# EAGLE design LedController2 (EAGLE 6.4)
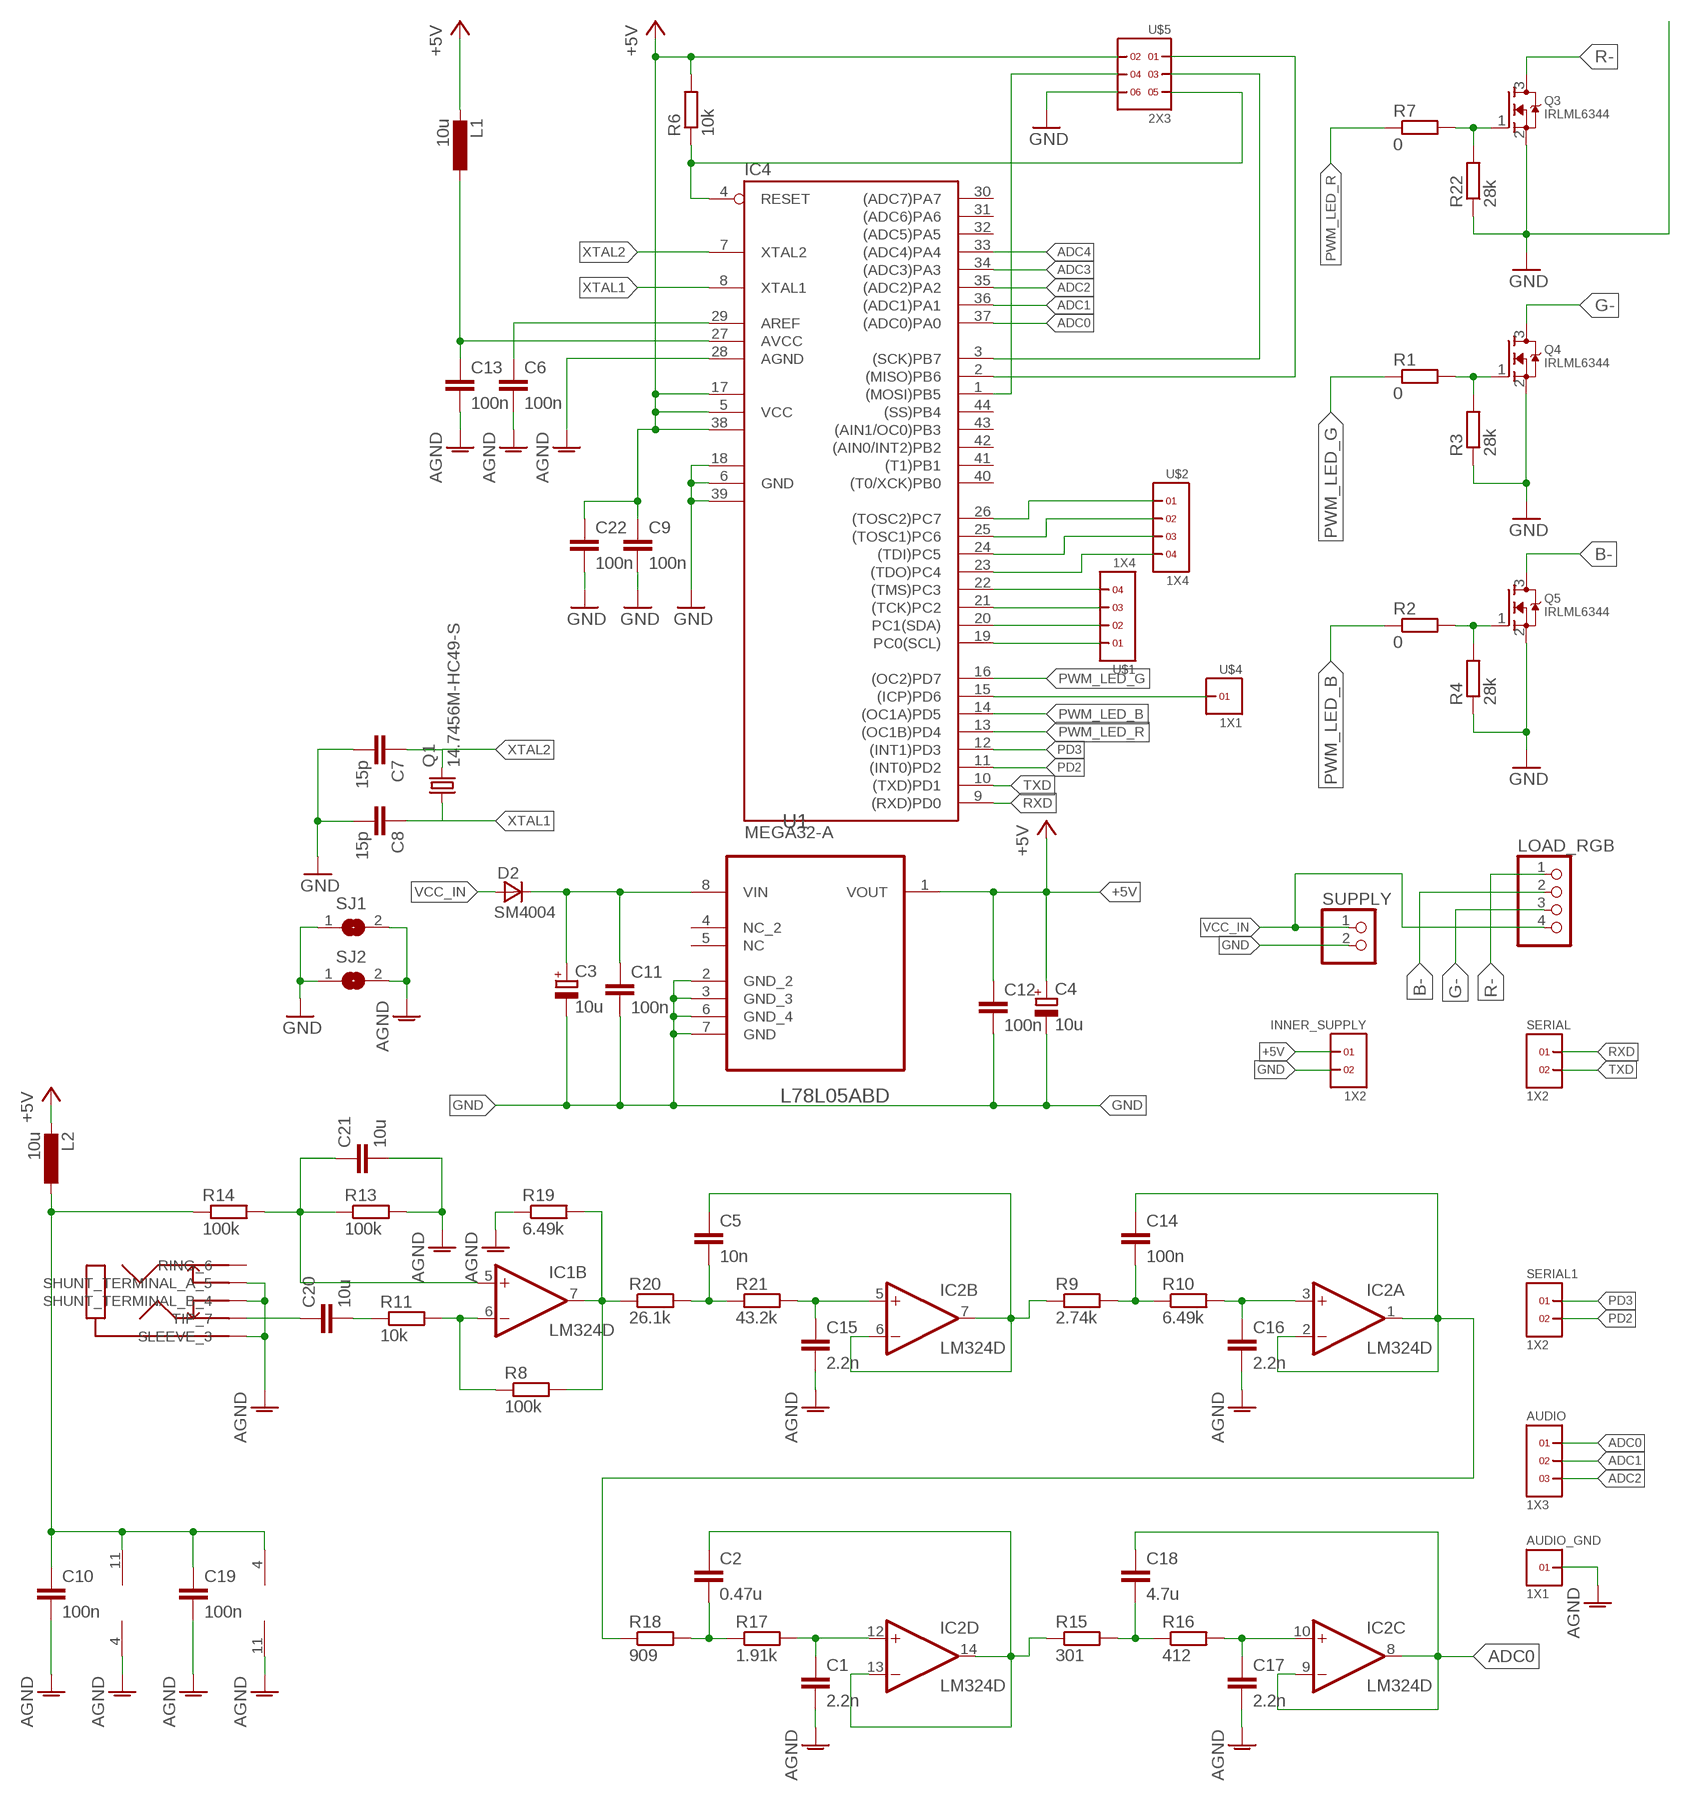
[diagram p0: schematic, sheet 1]

## Parts
AUDIO  1X3  [1X3]
AUDIO_GND  1X1  [1X1]
C1  2.2n  C-EUC0805  [C0805]
C2  0.47u  C-EUC0805  [C0805]
C3  10u  CPOL-EUSMCC  [SMC_C]
C4  10u  CPOL-EUSMCC  [SMC_C]
C5  10n  C-EUC0805  [C0805]
C6  100n  C-EUC0805  [C0805]
C7  15p  C-EUC0805  [C0805]
C8  15p  C-EUC0805  [C0805]
C9  100n  C-EUC0805  [C0805]
C10  100n  C-EUC0805  [C0805]
C11  100n  C-EUC0805  [C0805]
C12  100n  C-EUC0805  [C0805]
C13  100n  C-EUC0805  [C0805]
C14  100n  C-EUC0805  [C0805]
C15  2.2n  C-EUC0805  [C0805]
C16  2.2n  C-EUC0805  [C0805]
C17  2.2n  C-EUC0805  [C0805]
C18  4.7u  C-EUC0805  [C0805]
C19  100n  C-EUC0805  [C0805]
C20  10u  C-EUC0805  [C0805]
C21  10u  C-EUC0805  [C0805]
C22  100n  C-EUC0805  [C0805]
D2  SM4004  [MELF-MLL41]
IC1  LM324D  [SO14]
IC2  LM324D  [SO14]
IC4  MEGA32-A  [TQFP44]
INNER_SUPPLY  1X2  [1X2]
L1  10u  L-EUL1812  [L1812]
L2  10u  L-EUL1812  [L1812]
LOAD_RGB  PINHD-1X4/90  [1X04/90]
Q1  14.7456M-HC49-S  CRYSTALHC49S  [HC49/S]
Q3  IRLML6344  MOSFET-NREFLOW  [SOT23]
Q4  IRLML6344  MOSFET-NREFLOW  [SOT23]
Q5  IRLML6344  MOSFET-NREFLOW  [SOT23]
R1  0  R-EU_R0805  [R0805]
R2  0  R-EU_R0805  [R0805]
R3  28k  R-EU_R0805  [R0805]
R4  28k  R-EU_R0805  [R0805]
R6  10k  R-EU_R0805  [R0805]
R7  0  R-EU_R0805  [R0805]
R8  100k  R-EU_R0805  [R0805]
R9  2.74k  R-EU_R0805  [R0805]
R10  6.49k  R-EU_R0805  [R0805]
R11  10k  R-EU_R0805  [R0805]
R13  100k  R-EU_R0805  [R0805]
R14  100k  R-EU_R0805  [R0805]
R15  301  R-EU_R0805  [R0805]
R16  412  R-EU_R0805  [R0805]
R17  1.91k  R-EU_R0805  [R0805]
R18  909  R-EU_R0805  [R0805]
R19  6.49k  R-EU_R0805  [R0805]
R20  26.1k  R-EU_R0805  [R0805]
R21  43.2k  R-EU_R0805  [R0805]
R22  28k  R-EU_R0805  [R0805]
SERIAL  1X2  [1X2]
SERIAL1  1X2  [1X2]
SJ1  SJ  [SJ]
SJ2  SJ  [SJ]
SUPPLY  PINHD-1X2/90  [1X02/90]
U1  L78L05ABD  [SOIC127P600X175-8N]
U$1  1X4  [1X4]
U$2  1X4  [1X4]
U$4  1X1  [1X1]
U$5  2X3  [2X3]
U$6  JACK35  [JACK35]

## Nets
+5V: C4.+ C9.1 C12.1 C22.1 IC4.5(VCC) IC4.17(VCC1) IC4.38(VCC2) INNER_SUPPLY.1 L1.2 L2.2 R6.2 U1.1(VOUT) U$5.2
ADC0: AUDIO.1 C18.1 IC2.8(C:OUT) IC2.9(C:-IN) IC4.37((ADC0)PA0)
ADC1: AUDIO.2 IC4.36((ADC1)PA1)
ADC2: AUDIO.3 IC4.35((ADC2)PA2)
ADC3: IC4.34((ADC3)PA3)
ADC4: IC4.33((ADC4)PA4)
AGND: AUDIO_GND.1 C1.2 C6.2 C10.2 C13.2 C15.2 C16.2 C17.2 C19.2 C21.2 IC1.11(P:V-) IC2.4(P:V+) IC4.28(AGND) R13.2 R19.1 SJ1.2 SJ2.2 U$6.SHUNT_TERMINAL_A_5 U$6.SHUNT_TERMINAL_B_4 U$6.SLEEVE_3
AREF: C6.1 IC4.29(AREF)
AVCC: C13.1 IC4.27(AVCC) L1.1
B-: LOAD_RGB.2 Q5.3(D)
G-: LOAD_RGB.3 Q4.3(D)
GND: C3.- C4.- C7.2 C8.2 C9.2 C11.2 C12.2 C22.2 IC4.6(GND) IC4.18(GND1) IC4.39(GND2) INNER_SUPPLY.2 Q3.2(S) Q4.2(S) Q5.2(S) R3.1 R4.1 R22.1 SJ1.1 SJ2.1 SUPPLY.2 U1.2(GND_2) U1.3(GND_3) U1.6(GND_4) U1.7(GND) U$5.6
N$1: C20.2 R11.1
N$2: Q3.1(G) R7.2 R22.2
N$3: IC4.3((SCK)PB7) U$5.3
N$4: IC4.2((MISO)PB6) U$5.1
N$5: Q4.1(G) R1.2 R3.2
N$6: C3.+ C11.1 D2.C U1.8(VIN)
N$7: IC1.7(B:OUT) R8.2 R19.2 R20.1
N$8: C14.2 R9.2 R10.1
N$9: Q5.1(G) R2.2 R4.2
N$10: IC4.1((MOSI)PB5) U$5.4
N$11: IC1.6(B:-IN) R8.1 R11.2
N$12: C5.1 IC2.6(B:-IN) IC2.7(B:OUT) R9.1
N$13: C10.1 C19.1 IC1.4(P:V+) IC2.11(P:V-) L2.1 R14.1
N$14: C21.1 IC1.5(B:+IN) R13.1 R14.2
N$15: C15.1 IC2.5(B:+IN) R21.2
N$16: C16.1 IC2.3(A:+IN) R10.2
N$17: C17.1 IC2.10(C:+IN) R16.2
N$18: C2.1 IC2.13(D:-IN) IC2.14(D:OUT) R15.1
N$19: C5.2 R20.2 R21.1
N$20: C18.2 R15.2 R16.1
N$21: C14.1 IC2.1(A:OUT) IC2.2(A:-IN) R18.1
N$22: C1.1 IC2.12(D:+IN) R17.2
N$23: C2.2 R17.1 R18.2
N$24: C20.1 U$6.TIP_7
N$25: IC4.22((TMS)PC3) U$1.4
N$26: IC4.21((TCK)PC2) U$1.3
N$27: IC4.20(PC1(SDA)) U$1.2
N$28: IC4.19(PC0(SCL)) U$1.1
N$29: IC4.23((TDO)PC4) U$2.4
N$30: IC4.24((TDI)PC5) U$2.3
N$33: IC4.25((TOSC1)PC6) U$2.2
N$34: IC4.26((TOSC2)PC7) U$2.1
N$35: IC4.15((ICP)PD6) U$4.1
PD2: IC4.11((INT0)PD2) SERIAL1.2
PD3: IC4.12((INT1)PD3) SERIAL1.1
PWM_LED_B: IC4.14((OC1A)PD5) R2.1
PWM_LED_G: IC4.16((OC2)PD7) R1.1
PWM_LED_R: IC4.13((OC1B)PD4) R7.1
R-: LOAD_RGB.1 Q3.3(D)
RESET: IC4.4(RESET) R6.1 U$5.5
RXD: IC4.9((RXD)PD0) SERIAL.1
TXD: IC4.10((TXD)PD1) SERIAL.2
VCC_IN: D2.A LOAD_RGB.4 SUPPLY.1
XTAL1: C8.1 IC4.8(XTAL1) Q1.1
XTAL2: C7.1 IC4.7(XTAL2) Q1.2
Unconnected: IC1.1(A:OUT) IC1.2(A:-IN) IC1.3(A:+IN) IC1.8(C:OUT) IC1.9(C:-IN) IC1.10(C:+IN) IC1.12(D:+IN) IC1.13(D:-IN) IC1.14(D:OUT) IC4.30((ADC7)PA7) IC4.31((ADC6)PA6) IC4.32((ADC5)PA5) IC4.40((T0/XCK)PB0) IC4.41((T1)PB1) IC4.42((AIN0/INT2)PB2) IC4.43((AIN1/OC0)PB3) IC4.44((SS)PB4) U1.4(NC_2) U1.5(NC) U$6.RING_6

## Library data of the parts
AUDIO = headers-2mm:1X3
AUDIO_GND U$4 = headers-2mm:1X1
C1 C2 C5-C22 = rcl:C-EU: CAPACITOR, European symbol
C3 C4 = rcl:CPOL-EU: POLARIZED CAPACITOR, European symbol
D2 = _mod_diode:SM400*: SM4001 .. SM4007 General Purpose Rectifier, 1 A SMD-Version of 1N4001 .. 1N4007 Case: MELF-MLL41 = DO 213 AB Author: Dipl.-Ing. FH Rainer Bayer HHN Hochschule Heilbronn, rainer.bayer@hs-heilbronn.de Ingenieurbüro ing-rb, mail@ing-rb.de
IC1 IC2 = linear:LM324: OP AMP
IC4 = avr-6:MEGA32: MICROCONTROLLER 32 Kbytes FLASH 2 Kbytes SRAM 1 Kbytes EEPROM USART 8-channel 10 bit ADC
INNER_SUPPLY SERIAL SERIAL1 = headers-2mm:1X2
L1 L2 = rcl:L-EU: INDUCTOR, European symbol
LOAD_RGB = pinhead:PINHD-1X4: PIN HEADER
Q1 = crystal:CRYSTAL: CRYSTAL; OC_FARNELL: 1667008; OC_NEWARK: unknown
Q3-Q5 = adafruit:MOSFET-N: N-Channel Mosfet 2N7002E - 60V 260mA SOT23 [Digikey: 2N7002ET1GOSTR-ND] - REEL BSH103 - 30V 850mA SOT23 [Digikey: 568-5013-1-ND]
R1-R4 R6-R11 R13-R22 = rcl:R-EU_: RESISTOR, European symbol
SJ1 SJ2 = jumper:SJ: SMD solder JUMPER
SUPPLY = pinhead:PINHD-1X2: PIN HEADER
U1 = l78l05ABD_smd_so8:L78L05ABD: POSITIVE VOLTAGE REGULATORS; MPN: L78L05ABD; OC_FARNELL: 1087098; OC_NEWARK: -; PACKAGE: 8-SOIC; SUPPLIER: STMICROELECTRONICS
U$1 U$2 = headers-2mm:1X4
U$5 = headers-2mm:2X3
U$6 = led-controller-2.1:JACK35

## Board
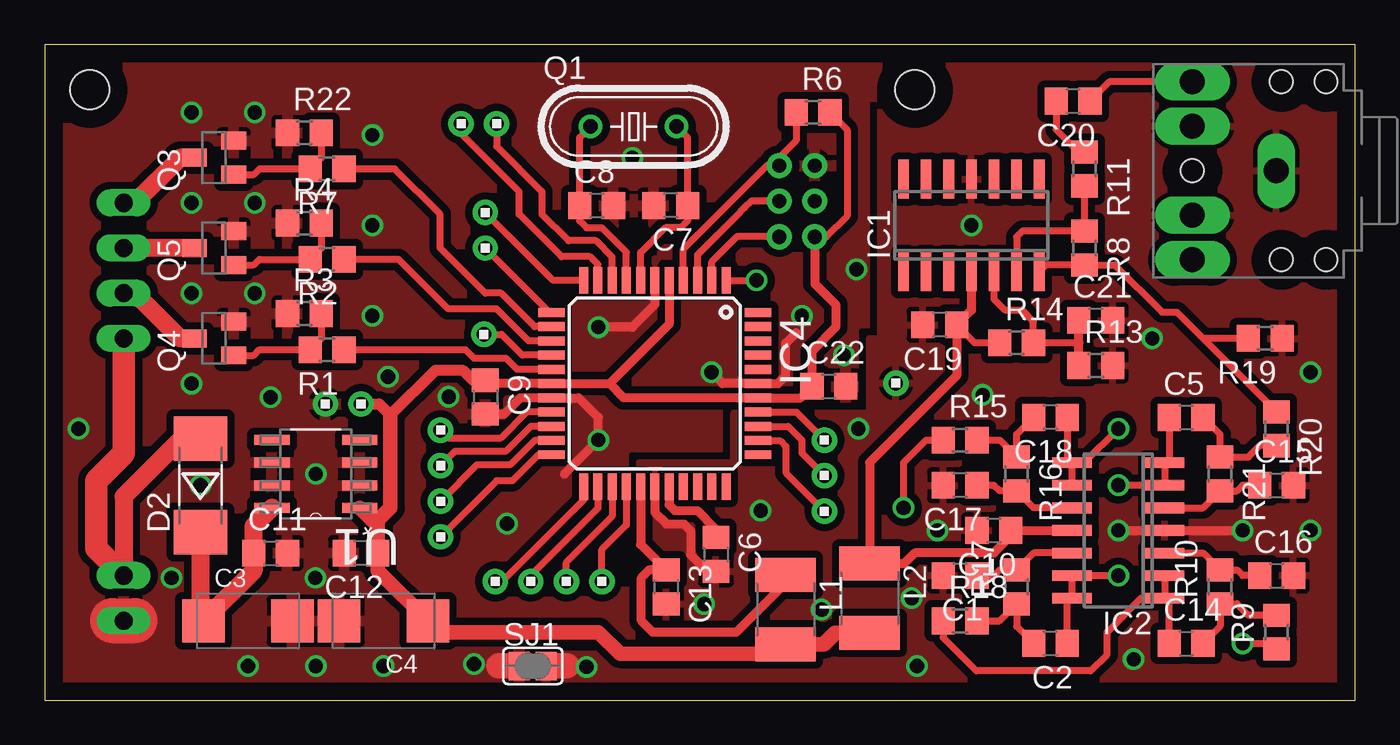
[diagram p1: board, top side]
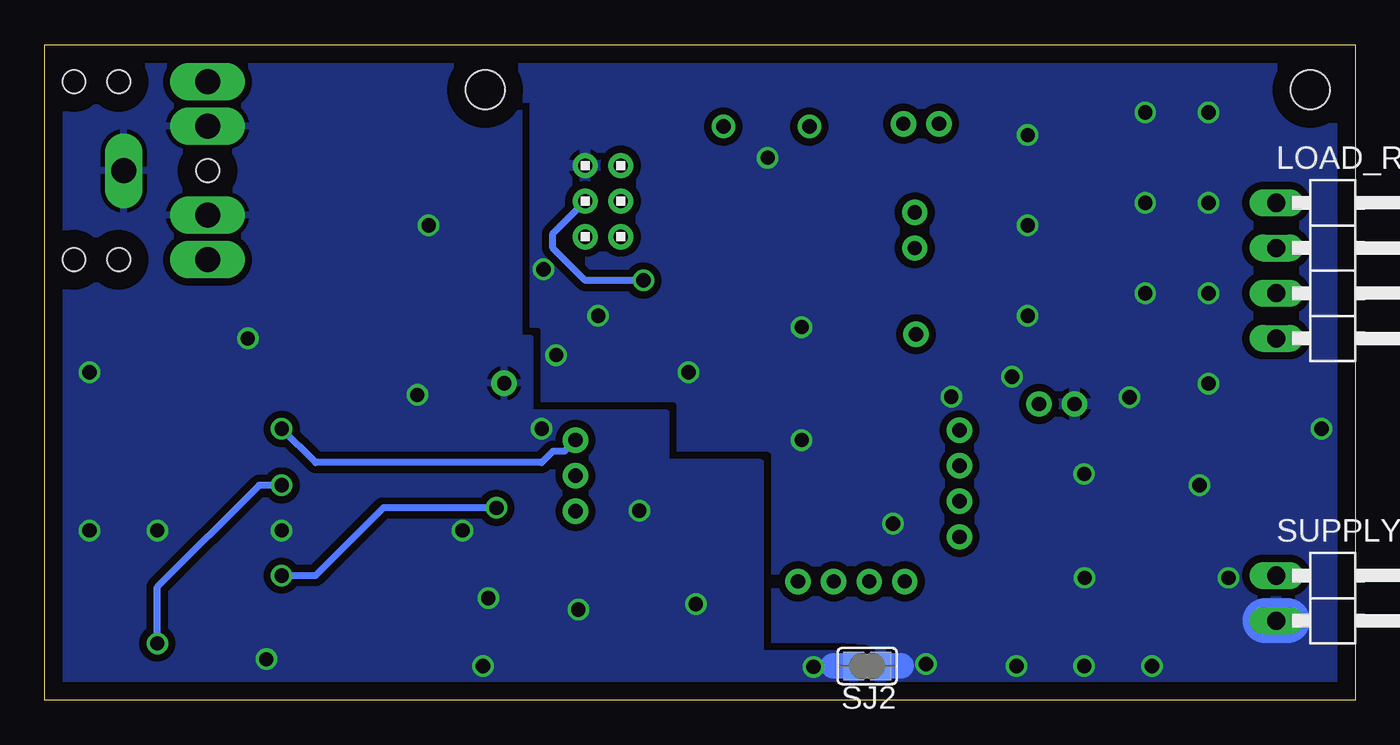
[diagram p2: board, bottom side, seen from below]

Size 73.65 x 36.86 mm. Coordinates in mm from the lower left corner, seen from the top.
Outline: 0,36.86 0,0 73.65,0 73.65,36.86 0,36.86
Copper layers (1*16): Top 0.035mm / dielectric 1.5mm / Bottom 0.035mm
Design rules "default": minimum track width 10mil, minimum drill 24mil, track to track 8mil, track to pad 8mil, pad to pad 8mil, via to via 8mil, smd to smd 8mil, copper to edge 40mil, drill to drill 8mil, minimum pad ring 10mil, minimum via ring 8mil, stop-mask expansion 4mil, vias tented up to drill 0mil, thermal gap 10mil
Holes 2.2 mm at 2.54,34.32 48.9,34.32

### Footprints (pad centres in the part's own frame; a part is rotated, then mirrored left to right if it is on the bottom)
1X3 = drill 0.8 pad 1.422: 1 0,0; 2 2,0; 3 4,0
1X1 = drill 0.8 pad 1.422: 1 0,0
C0805 = smd 1.3 x 1.5: 1 -0.95,0; 2 0.95,0
SMC_C = smd 2.4 x 2.4: + -2.5,0; - 2.5,0
MELF-MLL41 = smd 2.5 x 3: A 2.625,0; C -2.625,0
SO14 = smd 0.6 x 2.2: 1 -3.81,-2.6; 2 -2.54,-2.6; 3 -1.27,-2.6; 4 0,-2.6; 5 1.27,-2.6; 6 2.54,-2.6; 7 3.81,-2.6; 8 3.81,2.6; 9 2.54,2.6; 10 1.27,2.6; 11 0,2.6; 12 -1.27,2.6; 13 -2.54,2.6; 14 -3.81,2.6
TQFP44 = smd 1.5 x 0.5: 1 -5.8,4; 2 -5.8,3.2; 3 -5.8,2.4; 4 -5.8,1.6; 5 -5.8,0.8; 6 -5.8,0; 7 -5.8,-0.8; 8 -5.8,-1.6; 9 -5.8,-2.4; 10 -5.8,-3.2; 11 -5.8,-4; 23 5.8,-4; 24 5.8,-3.2; 25 5.8,-2.4; 26 5.8,-1.6; 27 5.8,-0.8; 28 5.8,0; 29 5.8,0.8; 30 5.8,1.6; 31 5.8,2.4; 32 5.8,3.2; 33 5.8,4 | smd 0.5 x 1.5: 12 -4,-5.8; 13 -3.2,-5.8; 14 -2.4,-5.8; 15 -1.6,-5.8; 16 -0.8,-5.8; 17 0,-5.8; 18 0.8,-5.8; 19 1.6,-5.8; 20 2.4,-5.8; 21 3.2,-5.8; 22 4,-5.8; 34 4,5.8; 35 3.2,5.8; 36 2.4,5.8; 37 1.6,5.8; 38 0.8,5.8; 39 0,5.8; 40 -0.8,5.8; 41 -1.6,5.8; 42 -2.4,5.8; 43 -3.2,5.8; 44 -4,5.8
1X2 = drill 0.8 pad 1.422: 1 0,0; 2 2,0
L1812 = smd 1.9 x 3.4: 1 -1.95,0; 2 1.95,0
1X04/90 = drill 1.016 long: 1 -3.81,-3.81; 2 -1.27,-3.81; 3 1.27,-3.81; 4 3.81,-3.81
HC49/S = drill 0.813: 1 -2.413,0; 2 2.413,0
SOT23 = smd 1 x 1.4: 1 -0.95,-1.1; 2 0.95,-1.1; 3 0,1.1
R0805 = smd 1.3 x 1.5: 1 -0.95,0; 2 0.95,0
SJ = smd 1.168 x 1.6: 1 -0.762,0; 2 0.762,0
1X02/90 = drill 1.016 long: 1 -1.27,-3.81; 2 1.27,-3.81
SOIC127P600X175-8N = smd 1.981 x 0.559: 1 -2.464,1.905; 2 -2.464,0.635; 3 -2.464,-0.635; 4 -2.464,-1.905; 5 2.464,-1.905; 6 2.464,-0.635; 7 2.464,0.635; 8 2.464,1.905
1X4 = drill 0.8 pad 1.422: 1 0,0; 2 2,0; 3 4,0; 4 6,0
2X3 = drill 0.8 pad 1.422: 1 0,0; 2 0,2; 3 2,0; 4 2,2; 5 4,0; 6 4,2
JACK35 = drill 1.4 long: RING_6 0,5; SHUNT_TERMINAL_A_5 0,2.5; SHUNT_TERMINAL_B_4 0,-2.5; SLEEVE_3 -4.7,0; TIP_7 0,-5 | hole 1.3: -7.5,5; -5,5; -5,-5; -7.5,-5; 0,0

### Placement (x,y rotation side)
AUDIO  43.81,14.63 270 top
AUDIO_GND  47.83,17.83 0 top
C1  51.44,7.01 180 top
C2  56.52,3.2 180 top
C3  11.43,4.47 0 top
C4  19.05,4.47 180 top
C5  64.14,15.9 0 top
C6  37.72,8.2 270 top
C7  35.18,27.81 180 top
C8  31.01,27.81 0 top
C9  24.77,17.04 270 top
C10  53.34,9.55 180 top
C11  12.7,8.28 0 top
C12  17.78,8.28 180 top
C13  34.92,6.38 270 top
C14  64.14,3.2 0 top
C15  69.22,12.09 0 top
C16  69.22,7.01 0 top
C17  51.44,12.09 180 top
C18  56.52,15.9 180 top
C19  50.29,21.11 180 top
C20  57.78,33.68 180 top
C21  59.05,21.36 0 top
C22  44.07,17.65 0 top
D2  8.76,12.09 90 top
IC1  52.07,26.7 0 top
IC2  60.33,9.55 90 top
IC4  34.29,17.81 270 top
INNER_SUPPLY  17.78,16.66 180 top
L1  41.63,5.11 270 top
L2  46.35,5.74 270 top
LOAD_RGB  0.64,24.16 270 bottom
Q1  33.1,32.26 0 top
Q3  9.53,30.51 90 top
Q4  9.53,20.35 90 top
Q5  9.53,25.43 90 top
R1  15.88,19.71 180 top
R2  15.88,24.79 180 top
R3  14.61,21.74 0 top
R4  14.61,26.82 0 top
R6  43.18,33.05 0 top
R7  15.88,29.87 180 top
R8  58.42,25.43 270 top
R9  69.22,3.84 90 top
R10  66.04,6.38 90 top
R11  58.42,29.87 270 top
R13  59.05,18.82 0 top
R14  54.61,20.09 0 top
R15  51.44,14.63 0 top
R16  54.61,12.73 270 top
R17  54.61,6.38 90 top
R18  51.44,4.47 0 top
R19  68.58,20.35 180 top
R20  69.22,15.27 270 top
R21  66.04,12.73 270 top
R22  14.61,31.9 0 top
SERIAL  25.4,32.41 180 top
SERIAL1  24.77,25.43 90 top
SJ1  27.43,1.93 0 top
SJ2  27.43,1.93 180 bottom
SUPPLY  0.64,5.74 270 bottom
U1  15.24,12.73 180 top
U$1  22.25,15.19 270 top
U$2  31.32,6.68 180 top
U$4  24.69,20.57 0 top
U$5  41.27,26.06 90 bottom
U$6  64.49,29.77 180 top

### Tracks (layer width: path | path; a pad name or v marks a point on that pad's centre or on a via)
+5V
  Top 0.406: R6.2 45.09,32.09 45.09,27.23 43.92,26.06 U$5.2
  Top 0.508: 31.75,17.81 IC4.17 24.95,17.81 C9.1 | 31.75,17.81 35.09,21.15 IC4.5 | 31.75,17.81 32.55,17.01 IC4.38 42.47,17.01 C22.1 43.12,19.65 44.45,20.98 44.45,22.25 43.27,23.43 U$5.2
  Top 0.61: 24.45,17.99 C9.1 24.07,17.99 23.5,18.57 21.97,18.57 19.43,16.03 | 19.43,15.9 19.43,16.03 | INNER_SUPPLY.1 18.8,16.66 19.43,16.03
  Top 0.813: 18.73,9.79 C12.1 18.73,7.29 C4.+ 22.18,3.84 31.11,3.84 32.33,2.62 41.09,2.62 L1.2 43.81,3.16 44.45,3.79 | 18.73,9.79 U1.1 | L2.2 44.45,3.79 | 44.45,3.79 44.41,3.79 43.81,3.2 | 18.73,9.79 18.73,10.12 19.43,10.82 19.43,15.9
ADC0  (via drill 0.8)
  Top 0.406: IC2.9 IC2.8 | C18.1 57.47,13.62 IC2.8 | v60.33,15.27 58.42,13.36 IC2.8 | IC4.37 42.24,16.21 AUDIO.1
  Bottom 0.406: AUDIO.1 44.45,14 45.09,14 45.72,13.36 58.42,13.36 v60.33,15.27
ADC1
  Top 0.406: IC4.36 41.77,15.41 42.55,14.63 42.55,13.9 AUDIO.2
ADC2
  Top 0.406: IC4.35 41.33,14.61 41.66,14.27 41.66,12.79 AUDIO.3
ADC4
  Top 0.406: IC4.33 38.29,11.8
AGND  (via drill 0.8)
  Top 0.508: v67.31,9.55 IC2.4 v60.33,9.55 | IC4.28 34.29,10.57 34.95,9.91 35.92,9.91 36.3,9.53 36.3,8.18 37.22,7.25 C6.2
  Top 1.422: 28.57,1.93 29.34,1.93
  Bottom 1.422: 28.57,1.93 29.34,1.93
  other vias: 40.23,10.67 48.72,5.74 43.66,5.11 61.19,2.31 49.02,1.93 50.16,9.55 52.7,17.17 62.23,20.35 45.72,15.27 52.07,26.7 37.06,5.41 30.45,1.88 71.12,18.44 71.12,9.55
  pour Bottom (isolate 0.406): 74.93,38.13 74.93,-0.61 33.4,-0.61 33.4,13.36 38.73,13.36 38.73,16.15 46.35,16.15 46.35,20.35 46.99,20.35 46.99,38.13
  pour Top (isolate 0.406): 74.3,-1.24 33.4,-1.24 33.4,13.36 38.73,13.36 38.73,16.15 46.35,16.15 46.35,20.35 46.99,20.35 46.99,38.76 74.3,38.76
  pour Bottom (isolate 0.406): 27.94,-2.51 27.94,1.93 28.57,2.57 33.66,2.57 34.29,1.93 34.29,-2.51
  pour Top (isolate 0.406): 27.94,-5.05 27.94,1.93 28.57,2.57 34.29,2.57 34.29,-5.05
AREF
  Top 0.508: IC4.29 35.09,10.99 35.41,10.67 36.66,10.67 37.72,9.61 C6.1
AVCC
  Top 0.508: IC4.27 33.49,8.76 C13.1 33.97,7.33 33.53,6.88 33.53,4.47 34.16,3.84 38.86,3.84 41.63,6.6 L1.1
B-
  Top 1.016: Q5.3 LOAD_RGB.2
G-
  Top 1.016: Q4.3 7.62,20.35 5.08,22.89 LOAD_RGB.3
GND  (via drill 0.8)
  Top 0.508: IC4.6 34.29,22.25 33.02,20.98 v31.11,20.98 | v37.47,18.44 38.1,17.81 IC4.39 41.2,17.81 41.63,18.24 41.63,20.07 42.23,20.66 | 29.21,12.73 v31.11,14.63 31.11,15.9 30.01,17.01 IC4.18 26.73,17.01 25.82,16.09 C9.2
  Top 1.422: 25.53,1.93 26.29,1.93
  Top 2.54: 3.81,4.47 5.08,4.47
  Bottom 1.422: 25.53,1.93 26.29,1.93
  Bottom 2.54: 3.81,4.47 5.08,4.47
  other vias: 15.21,6.88 15.24,12.73 8.26,33.05 8.26,22.89 8.26,27.97 25.98,9.93 22.71,17.07 15.24,1.93 11.43,1.93 19.3,18.19 12.7,17.04 8.26,17.81 1.91,15.27 33.02,30.51 42.55,21.62 44.91,19.41 18.41,26.7 18.41,21.62 18.41,31.78 45.62,24.23 11.81,33.05 11.81,27.97 11.81,22.89 8.76,12.09 7.14,6.88 19.05,1.93 24.13,2.03
  pour Bottom (isolate 0.406, rank 4): -2.54,39.4 47.62,39.4 47.62,20.35 45.72,20.35 45.72,9.55 33.27,9.55 33.27,-0.61 -2.54,-0.61
  pour Top (isolate 0.406, rank 4): -1.27,38.13 47.62,38.13 47.62,20.35 45.72,20.35 45.72,9.55 33.27,9.55 33.27,-1.24 -1.27,-1.24
N$1
  Top 0.406: R11.1 58.1,30.82 56.84,32.09 C20.2
N$2
  Top 0.406: Q3.1 11.75,29.56 12.06,29.87 R7.2 15.55,30.5 R22.2
N$3
  Top 0.406: IC4.3 36.69,25.06 38.85,27.22 39.32,27.69 39.69,28.06 U$5.3
N$4
  Top 0.406: IC4.2 37.49,24.66 38.89,26.06 U$5.1
N$5
  Top 0.406: Q4.1 11.75,19.4 12.06,19.71 R1.2 15.55,20.34 R3.2
N$6
  Top 0.813: 8.76,4.64 C3.+
  Top 1.016: U1.8 11.75,9.79 C11.1 11.75,7.29 C3.+ | D2.C 8.76,4.64
N$7
  Top 0.406: 58.67,24.1 R8.2 | 65.08,20.35 R20.1 | R19.2 65.08,20.35 | R8.2 56.26,24.48 IC1.7 | R8.2 60.13,24.48 62.79,21.82 63.61,21.82 65.08,20.35
N$8
  Top 0.406: R9.2 67.63,4.79 66.99,5.43 R10.1 66.04,4.16 C14.2
N$9
  Top 0.406: Q5.1 11.75,24.48 12.06,24.79 R2.2 15.55,25.42 R4.2
N$10  (via drill 0.8)
  Top 0.406: IC4.1 v40.01,23.61
  Bottom 0.406: v40.01,23.61 43.27,23.61 45.09,25.43 45.09,26.25 U$5.4
N$11
  Top 0.406: R11.2 R8.1 54.92,26.38 54.61,26.06 IC1.6
N$12  (via drill 0.8)
  Top 0.406: C5.1 63.19,13.62 IC2.7 IC2.6 v60.33,12.09 | v67.31,3.2 68.9,3.2 R9.1
  Bottom 0.406: v60.33,12.09 61.59,12.09 67.31,6.38 v67.31,3.2
N$13
  Top 0.406: R14.1 52.26,20.09 C19.1
  Top 0.508: IC2.11 C10.1 54.29,9.23 53.34,8.28 48.9,8.28 48.3,7.69 L2.1 46.35,13.36 51.24,18.25 C19.1 52.07,21.94 IC1.4
N$14
  Top 0.406: 58.1,20.09 R14.2 55.56,21.3 54.91,21.95 53.95,21.95 53.34,22.56 IC1.5
  Top 0.508: R13.1 58.1,20.09 C21.1
N$15
  Top 0.406: C15.1 67.31,12.09 67,11.78 R21.2 65.08,10.82 IC2.5
N$16
  Top 0.406: IC2.3 65.08,8.28 R10.2 67,7.33 67.31,7.01 C16.1
N$17
  Top 0.406: IC2.10 55.56,10.82 R16.2 53.66,11.78 53.34,12.09 C17.1
N$18  (via drill 0.8)
  Top 0.406: C2.1 57.47,5.48 IC2.14 IC2.13 v60.33,7.01 | v48.26,10.82 48.26,13.36 49.53,14.63 R15.1
  Bottom 0.406: v60.33,7.01 58.42,7.01 54.61,10.82 v48.26,10.82
N$19
  Top 0.406: C5.2 66.04,14.95 R21.1 67.62,13.68 68.27,14.32 R20.2
N$20
  Top 0.406: 55.56,15.59 C18.2 54.61,14.95 R16.1 | R16.1 | R15.2 53.66,14.63 R16.1
N$21
  Top 0.406: IC2.2 IC2.1 | C14.1 63.19,5.48 IC2.1 | IC2.1 61.59,5.74 59.69,3.84 59.69,2.57 58.78,1.65 52.35,1.65 50.48,3.52 R18.1
N$22
  Top 0.406: IC2.12 55.56,8.28 R17.2 53.66,7.33 53.34,7.01 C1.1
N$23
  Top 0.406: R17.1 54.61,4.16 C2.2 | R17.1 | R18.2 53.66,4.47 R17.1
N$24
  Top 0.406: U$6.TIP_7 59.82,34.77 C20.1
N$25
  Top 0.406: IC4.22 27.75,13.81 26.29,12.34 25.41,12.34 U$1.4
N$26
  Top 0.406: IC4.21 27.53,14.61 26.16,13.23 24.3,13.23 U$1.3
N$27
  Top 0.406: IC4.20 27.32,15.41 25.91,14 23.06,14 U$1.2
N$28
  Top 0.406: IC4.19 27.1,16.21 25.65,14.76 22.68,14.76 U$1.1
N$29
  Top 0.406: IC4.23 30.29,11.27 25.7,6.68 U$2.4
N$30
  Top 0.406: IC4.24 31.09,10.8 27.32,7.02 U$2.3
N$33
  Top 0.406: IC4.25 31.89,10.33 29.32,7.75 U$2.2
N$34
  Top 0.406: IC4.26 32.69,9.86 31.32,8.48 U$2.1
N$35
  Top 0.406: IC4.15 26.85,19.41 25.68,20.57 U$4.1
PD2
  Top 0.406: IC4.11 28.59,23.61 SERIAL1.2
PD3
  Top 0.406: IC4.12 28.39,21.81 SERIAL1.1
PWM_LED_B
  Top 0.406: R2.1 19.89,24.79 22.68,22 25.4,22 27.19,20.21 IC4.14
PWM_LED_G
  Top 0.406: IC4.16 26.56,18.61 25.93,19.23 24.13,19.23 23.65,19.71 R1.1
PWM_LED_R
  Top 0.406: R7.1 19.68,29.87 22.23,27.33 22.23,25.43 24.77,22.89 25.65,22.89 27.53,21.01 IC4.13
R-
  Top 1.016: Q3.3 7.62,30.51 5.08,27.97 LOAD_RGB.1
RESET
  Top 0.406: IC4.4 35.89,25.37 40.58,30.06 U$5.5 41.27,30.51 42.23,31.46 R6.1
RXD
  Top 0.406: IC4.9 31.89,24.93 30.99,25.83 29.44,25.83 27.94,27.33 27.94,28.6 25.4,31.14 SERIAL.1
TXD
  Top 0.406: IC4.10 31.09,24.51 30.66,24.94 29.06,24.94 26.67,27.33 26.67,28.6 23.5,31.78 23.5,32.32 SERIAL.2
VCC_IN
  Top 1.016: SUPPLY.1 4.45,11.46 7.71,14.72 D2.A
  Top 1.27: LOAD_RGB.4 4.45,13.87 2.92,12.34 2.92,8.53 SUPPLY.1
XTAL1
  Top 0.406: Q1.1 30.06,31.64 C8.1 30.06,26.96 30.45,26.57 31.31,26.57 32.69,25.19 IC4.8
XTAL2
  Top 0.406: Q1.2 36.13,31.64 C7.1 36.13,26.96 35.74,26.57 34.88,26.57 33.49,25.17 IC4.7